# EasyEDA Pro project ProPrj_HTXStudio_OneHanded_Keyboard.epro, schematic 键盘轴_MR

## Sheets
1 keys
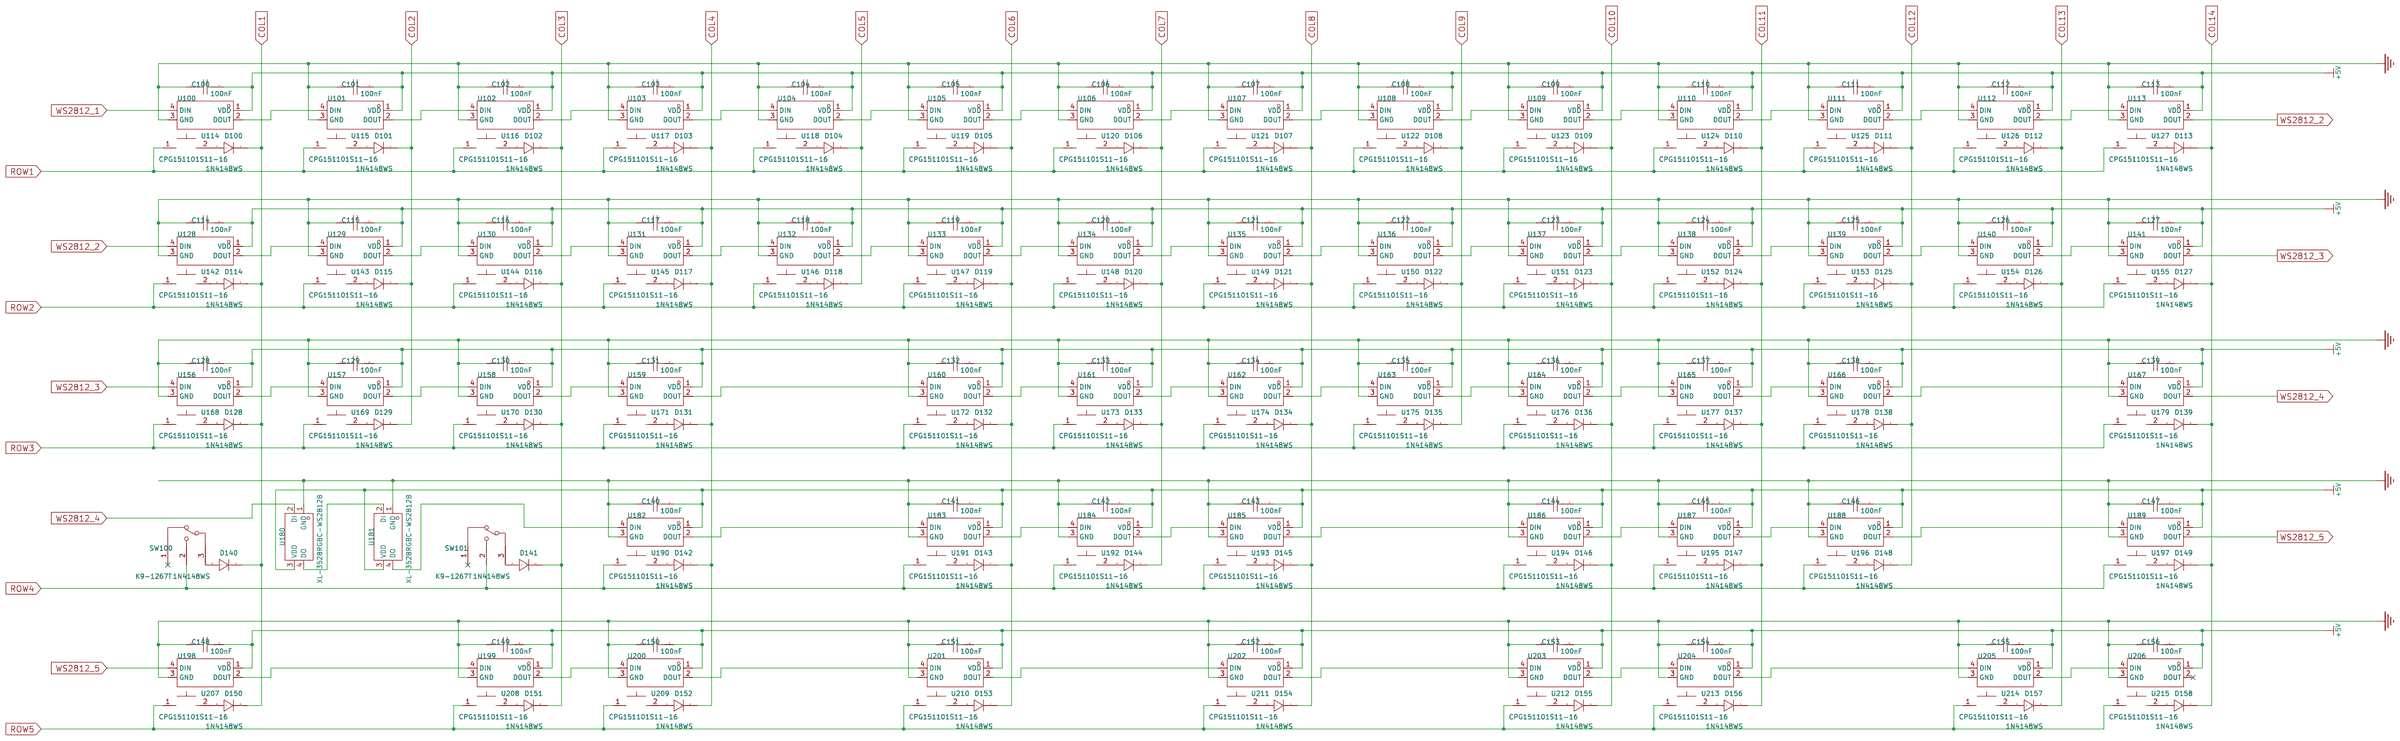
[diagram p7: keys]
2 core
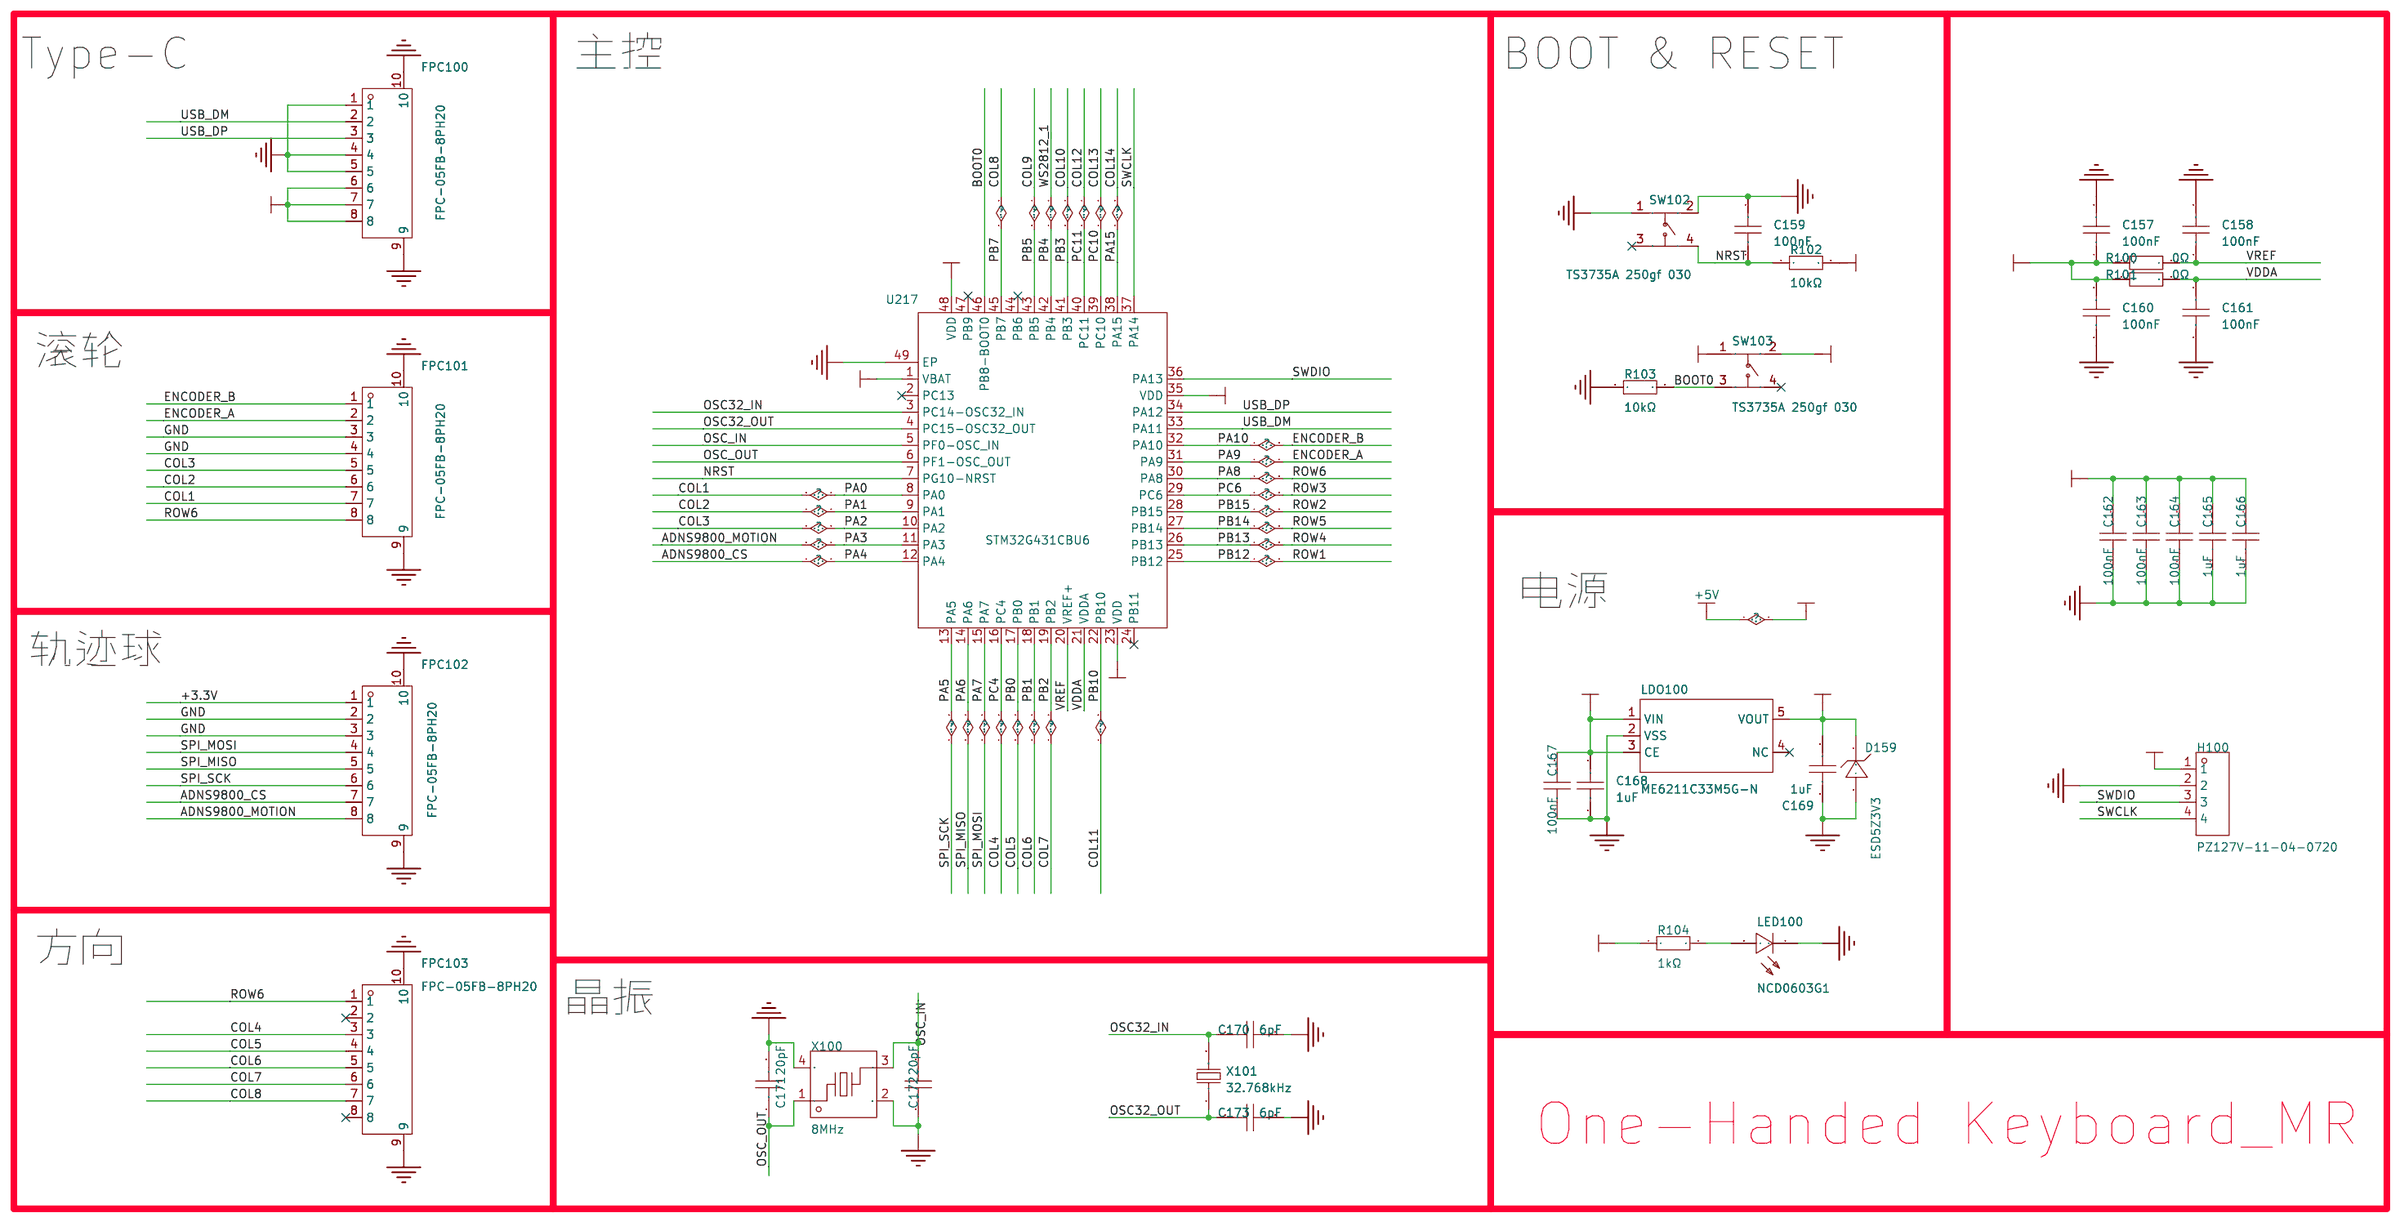
[diagram p8: core]

## Parts
sheet core
C157  100nF  [C0402]
C158  100nF  [C0402]
C159  100nF  [C0402]
C160  100nF  [C0402]
C161  100nF  [C0402]
C162  100nF  [C0402]
C163  100nF  [C0402]
C164  100nF  [C0402]
C165  1uF  [C0402]
C166  1uF  [C0402]
C167  100nF  [C0402]
C168  1uF  [C0402]
C169  1uF  [C0402]
C170  6pF  [C0402]
C171  20pF  [C0402]
C172  20pF  [C0402]
C173  6pF  [C0402]
D159  ESD5Z3V3  [SOD-523_L1.2-W0.8-LS1.6-RD]
FPC100  FPC-05FB-8PH20  [FPC-SMD_8P-P0.50_XUNPU_FPC-05FB-8PH20]
FPC101  FPC-05FB-8PH20  [FPC-SMD_8P-P0.50_XUNPU_FPC-05FB-8PH20]
FPC102  FPC-05FB-8PH20  [FPC-SMD_8P-P0.50_XUNPU_FPC-05FB-8PH20]
FPC103  FPC-05FB-8PH20  [FPC-SMD_8P-P0.50_XUNPU_FPC-05FB-8PH20]
H100  PZ127V-11-04-0720  [HDR-TH_4P-P1.27-V-M]
LDO100  ME6211C33M5G-N  [SOT-23-5_L3.0-W1.7-P0.95-LS2.8-BL]
LED100  NCD0603G1  [LED0603-RD_1]
R100  0Ω  [R0402]
R101  0Ω  [R0402]
R102  10kΩ  [R0402]
R103  10kΩ  [R0402]
R104  1kΩ  [R0402]
SW102  TS3735A 250gf 030  [SW-SMD_4P-L3.7-W3.7-P2.70-LS3.7]
SW103  TS3735A 250gf 030  [SW-SMD_4P-L3.7-W3.7-P2.70-LS3.7]
U217  STM32G431CBU6  [VQFN-48_L7.0-W7.0-P0.50-BL-EP5.5]
X100  8MHz  [CRYSTAL-SMD_4P-L3.2-W2.5-BL]
X101  32.768kHz  [FC-135R_L3.2-W1.5]
sheet keys
C100  100nF  [C0603]
C101  100nF  [C0603]
C102  100nF  [C0603]
C103  100nF  [C0603]
C104  100nF  [C0603]
C105  100nF  [C0603]
C106  100nF  [C0603]
C107  100nF  [C0603]
C108  100nF  [C0603]
C109  100nF  [C0603]
C110  100nF  [C0603]
C111  100nF  [C0603]
C112  100nF  [C0603]
C113  100nF  [C0603]
C114  100nF  [C0603]
C115  100nF  [C0603]
C116  100nF  [C0603]
C117  100nF  [C0603]
C118  100nF  [C0603]
C119  100nF  [C0603]
C120  100nF  [C0603]
C121  100nF  [C0603]
C122  100nF  [C0603]
C123  100nF  [C0603]
C124  100nF  [C0603]
C125  100nF  [C0603]
C126  100nF  [C0603]
C127  100nF  [C0603]
C128  100nF  [C0603]
C129  100nF  [C0603]
C130  100nF  [C0603]
C131  100nF  [C0603]
C132  100nF  [C0603]
C133  100nF  [C0603]
C134  100nF  [C0603]
C135  100nF  [C0603]
C136  100nF  [C0603]
C137  100nF  [C0603]
C138  100nF  [C0603]
C139  100nF  [C0603]
C140  100nF  [C0603]
C141  100nF  [C0603]
C142  100nF  [C0603]
C143  100nF  [C0603]
C144  100nF  [C0603]
C145  100nF  [C0603]
C146  100nF  [C0603]
C147  100nF  [C0603]
C148  100nF  [C0603]
C149  100nF  [C0603]
C150  100nF  [C0603]
C151  100nF  [C0603]
C152  100nF  [C0603]
C153  100nF  [C0603]
C154  100nF  [C0603]
C155  100nF  [C0603]
C156  100nF  [C0603]
D100  1N4148WS  [SOD-323_L1.8-W1.3-LS2.5-RD]
D101  1N4148WS  [SOD-323_L1.8-W1.3-LS2.5-RD]
D102  1N4148WS  [SOD-323_L1.8-W1.3-LS2.5-RD]
D103  1N4148WS  [SOD-323_L1.8-W1.3-LS2.5-RD]
D104  1N4148WS  [SOD-323_L1.8-W1.3-LS2.5-RD]
D105  1N4148WS  [SOD-323_L1.8-W1.3-LS2.5-RD]
D106  1N4148WS  [SOD-323_L1.8-W1.3-LS2.5-RD]
D107  1N4148WS  [SOD-323_L1.8-W1.3-LS2.5-RD]
D108  1N4148WS  [SOD-323_L1.8-W1.3-LS2.5-RD]
D109  1N4148WS  [SOD-323_L1.8-W1.3-LS2.5-RD]
D110  1N4148WS  [SOD-323_L1.8-W1.3-LS2.5-RD]
D111  1N4148WS  [SOD-323_L1.8-W1.3-LS2.5-RD]
D112  1N4148WS  [SOD-323_L1.8-W1.3-LS2.5-RD]
D113  1N4148WS  [SOD-323_L1.8-W1.3-LS2.5-RD]
D114  1N4148WS  [SOD-323_L1.8-W1.3-LS2.5-RD]
D115  1N4148WS  [SOD-323_L1.8-W1.3-LS2.5-RD]
D116  1N4148WS  [SOD-323_L1.8-W1.3-LS2.5-RD]
D117  1N4148WS  [SOD-323_L1.8-W1.3-LS2.5-RD]
D118  1N4148WS  [SOD-323_L1.8-W1.3-LS2.5-RD]
D119  1N4148WS  [SOD-323_L1.8-W1.3-LS2.5-RD]
D120  1N4148WS  [SOD-323_L1.8-W1.3-LS2.5-RD]
D121  1N4148WS  [SOD-323_L1.8-W1.3-LS2.5-RD]
D122  1N4148WS  [SOD-323_L1.8-W1.3-LS2.5-RD]
D123  1N4148WS  [SOD-323_L1.8-W1.3-LS2.5-RD]
D124  1N4148WS  [SOD-323_L1.8-W1.3-LS2.5-RD]
D125  1N4148WS  [SOD-323_L1.8-W1.3-LS2.5-RD]
D126  1N4148WS  [SOD-323_L1.8-W1.3-LS2.5-RD]
D127  1N4148WS  [SOD-323_L1.8-W1.3-LS2.5-RD]
D128  1N4148WS  [SOD-323_L1.8-W1.3-LS2.5-RD]
D129  1N4148WS  [SOD-323_L1.8-W1.3-LS2.5-RD]
D130  1N4148WS  [SOD-323_L1.8-W1.3-LS2.5-RD]
D131  1N4148WS  [SOD-323_L1.8-W1.3-LS2.5-RD]
D132  1N4148WS  [SOD-323_L1.8-W1.3-LS2.5-RD]
D133  1N4148WS  [SOD-323_L1.8-W1.3-LS2.5-RD]
D134  1N4148WS  [SOD-323_L1.8-W1.3-LS2.5-RD]
D135  1N4148WS  [SOD-323_L1.8-W1.3-LS2.5-RD]
D136  1N4148WS  [SOD-323_L1.8-W1.3-LS2.5-RD]
D137  1N4148WS  [SOD-323_L1.8-W1.3-LS2.5-RD]
D138  1N4148WS  [SOD-323_L1.8-W1.3-LS2.5-RD]
D139  1N4148WS  [SOD-323_L1.8-W1.3-LS2.5-RD]
D140  1N4148WS  [SOD-323_L1.8-W1.3-LS2.5-RD]
D141  1N4148WS  [SOD-323_L1.8-W1.3-LS2.5-RD]
D142  1N4148WS  [SOD-323_L1.8-W1.3-LS2.5-RD]
D143  1N4148WS  [SOD-323_L1.8-W1.3-LS2.5-RD]
D144  1N4148WS  [SOD-323_L1.8-W1.3-LS2.5-RD]
D145  1N4148WS  [SOD-323_L1.8-W1.3-LS2.5-RD]
D146  1N4148WS  [SOD-323_L1.8-W1.3-LS2.5-RD]
D147  1N4148WS  [SOD-323_L1.8-W1.3-LS2.5-RD]
D148  1N4148WS  [SOD-323_L1.8-W1.3-LS2.5-RD]
D149  1N4148WS  [SOD-323_L1.8-W1.3-LS2.5-RD]
D150  1N4148WS  [SOD-323_L1.8-W1.3-LS2.5-RD]
D151  1N4148WS  [SOD-323_L1.8-W1.3-LS2.5-RD]
D152  1N4148WS  [SOD-323_L1.8-W1.3-LS2.5-RD]
D153  1N4148WS  [SOD-323_L1.8-W1.3-LS2.5-RD]
D154  1N4148WS  [SOD-323_L1.8-W1.3-LS2.5-RD]
D155  1N4148WS  [SOD-323_L1.8-W1.3-LS2.5-RD]
D156  1N4148WS  [SOD-323_L1.8-W1.3-LS2.5-RD]
D157  1N4148WS  [SOD-323_L1.8-W1.3-LS2.5-RD]
D158  1N4148WS  [SOD-323_L1.8-W1.3-LS2.5-RD]
SW100  K9-1267T  [SW-TH_K9-1267T]
SW101  K9-1267T  [SW-TH_K9-1267T]
U100  Yo-WS2812B-3528反贴雾状  [LED-SMD_L3.2-W2.8_YO-WS2812B-3528]
U101  Yo-WS2812B-3528反贴雾状  [LED-SMD_L3.2-W2.8_YO-WS2812B-3528]
U102  Yo-WS2812B-3528反贴雾状  [LED-SMD_L3.2-W2.8_YO-WS2812B-3528]
U103  Yo-WS2812B-3528反贴雾状  [LED-SMD_L3.2-W2.8_YO-WS2812B-3528]
U104  Yo-WS2812B-3528反贴雾状  [LED-SMD_L3.2-W2.8_YO-WS2812B-3528]
U105  Yo-WS2812B-3528反贴雾状  [LED-SMD_L3.2-W2.8_YO-WS2812B-3528]
U106  Yo-WS2812B-3528反贴雾状  [LED-SMD_L3.2-W2.8_YO-WS2812B-3528]
U107  Yo-WS2812B-3528反贴雾状  [LED-SMD_L3.2-W2.8_YO-WS2812B-3528]
U108  Yo-WS2812B-3528反贴雾状  [LED-SMD_L3.2-W2.8_YO-WS2812B-3528]
U109  Yo-WS2812B-3528反贴雾状  [LED-SMD_L3.2-W2.8_YO-WS2812B-3528]
U110  Yo-WS2812B-3528反贴雾状  [LED-SMD_L3.2-W2.8_YO-WS2812B-3528]
U111  Yo-WS2812B-3528反贴雾状  [LED-SMD_L3.2-W2.8_YO-WS2812B-3528]
U112  Yo-WS2812B-3528反贴雾状  [LED-SMD_L3.2-W2.8_YO-WS2812B-3528]
U113  Yo-WS2812B-3528反贴雾状  [LED-SMD_L3.2-W2.8_YO-WS2812B-3528]
U114  CPG151101S11-16  [SMD_KEYBOARD-SW]
U115  CPG151101S11-16  [SMD_KEYBOARD-SW]
U116  CPG151101S11-16  [SMD_KEYBOARD-SW]
U117  CPG151101S11-16  [SMD_KEYBOARD-SW]
U118  CPG151101S11-16  [SMD_KEYBOARD-SW]
U119  CPG151101S11-16  [SMD_KEYBOARD-SW]
U120  CPG151101S11-16  [SMD_KEYBOARD-SW]
U121  CPG151101S11-16  [SMD_KEYBOARD-SW]
U122  CPG151101S11-16  [SMD_KEYBOARD-SW]
U123  CPG151101S11-16  [SMD_KEYBOARD-SW]
U124  CPG151101S11-16  [SMD_KEYBOARD-SW]
U125  CPG151101S11-16  [SMD_KEYBOARD-SW]
U126  CPG151101S11-16  [SMD_KEYBOARD-SW]
U127  CPG151101S11-16  [SMD_KEYBOARD-SW]
U128  Yo-WS2812B-3528反贴雾状  [LED-SMD_L3.2-W2.8_YO-WS2812B-3528]
U129  Yo-WS2812B-3528反贴雾状  [LED-SMD_L3.2-W2.8_YO-WS2812B-3528]
U130  Yo-WS2812B-3528反贴雾状  [LED-SMD_L3.2-W2.8_YO-WS2812B-3528]
U131  Yo-WS2812B-3528反贴雾状  [LED-SMD_L3.2-W2.8_YO-WS2812B-3528]
U132  Yo-WS2812B-3528反贴雾状  [LED-SMD_L3.2-W2.8_YO-WS2812B-3528]
U133  Yo-WS2812B-3528反贴雾状  [LED-SMD_L3.2-W2.8_YO-WS2812B-3528]
U134  Yo-WS2812B-3528反贴雾状  [LED-SMD_L3.2-W2.8_YO-WS2812B-3528]
U135  Yo-WS2812B-3528反贴雾状  [LED-SMD_L3.2-W2.8_YO-WS2812B-3528]
U136  Yo-WS2812B-3528反贴雾状  [LED-SMD_L3.2-W2.8_YO-WS2812B-3528]
U137  Yo-WS2812B-3528反贴雾状  [LED-SMD_L3.2-W2.8_YO-WS2812B-3528]
U138  Yo-WS2812B-3528反贴雾状  [LED-SMD_L3.2-W2.8_YO-WS2812B-3528]
U139  Yo-WS2812B-3528反贴雾状  [LED-SMD_L3.2-W2.8_YO-WS2812B-3528]
U140  Yo-WS2812B-3528反贴雾状  [LED-SMD_L3.2-W2.8_YO-WS2812B-3528]
U141  Yo-WS2812B-3528反贴雾状  [LED-SMD_L3.2-W2.8_YO-WS2812B-3528]
U142  CPG151101S11-16  [SMD_KEYBOARD-SW]
U143  CPG151101S11-16  [SMD_KEYBOARD-SW]
U144  CPG151101S11-16  [SMD_KEYBOARD-SW]
U145  CPG151101S11-16  [SMD_KEYBOARD-SW]
U146  CPG151101S11-16  [SMD_KEYBOARD-SW]
U147  CPG151101S11-16  [SMD_KEYBOARD-SW]
U148  CPG151101S11-16  [SMD_KEYBOARD-SW]
U149  CPG151101S11-16  [SMD_KEYBOARD-SW]
U150  CPG151101S11-16  [SMD_KEYBOARD-SW]
U151  CPG151101S11-16  [SMD_KEYBOARD-SW]
U152  CPG151101S11-16  [SMD_KEYBOARD-SW]
U153  CPG151101S11-16  [SMD_KEYBOARD-SW]
U154  CPG151101S11-16  [SMD_KEYBOARD-SW]
U155  CPG151101S11-16  [SMD_KEYBOARD-SW]
U156  Yo-WS2812B-3528反贴雾状  [LED-SMD_L3.2-W2.8_YO-WS2812B-3528]
U157  Yo-WS2812B-3528反贴雾状  [LED-SMD_L3.2-W2.8_YO-WS2812B-3528]
U158  Yo-WS2812B-3528反贴雾状  [LED-SMD_L3.2-W2.8_YO-WS2812B-3528]
U159  Yo-WS2812B-3528反贴雾状  [LED-SMD_L3.2-W2.8_YO-WS2812B-3528]
U160  Yo-WS2812B-3528反贴雾状  [LED-SMD_L3.2-W2.8_YO-WS2812B-3528]
U161  Yo-WS2812B-3528反贴雾状  [LED-SMD_L3.2-W2.8_YO-WS2812B-3528]
U162  Yo-WS2812B-3528反贴雾状  [LED-SMD_L3.2-W2.8_YO-WS2812B-3528]
U163  Yo-WS2812B-3528反贴雾状  [LED-SMD_L3.2-W2.8_YO-WS2812B-3528]
U164  Yo-WS2812B-3528反贴雾状  [LED-SMD_L3.2-W2.8_YO-WS2812B-3528]
U165  Yo-WS2812B-3528反贴雾状  [LED-SMD_L3.2-W2.8_YO-WS2812B-3528]
U166  Yo-WS2812B-3528反贴雾状  [LED-SMD_L3.2-W2.8_YO-WS2812B-3528]
U167  Yo-WS2812B-3528反贴雾状  [LED-SMD_L3.2-W2.8_YO-WS2812B-3528]
U168  CPG151101S11-16  [SMD_KEYBOARD-SW]
U169  CPG151101S11-16  [SMD_KEYBOARD-SW]
U170  CPG151101S11-16  [SMD_KEYBOARD-SW]
U171  CPG151101S11-16  [SMD_KEYBOARD-SW]
U172  CPG151101S11-16  [SMD_KEYBOARD-SW]
U173  CPG151101S11-16  [SMD_KEYBOARD-SW]
U174  CPG151101S11-16  [SMD_KEYBOARD-SW]
U175  CPG151101S11-16  [SMD_KEYBOARD-SW]
U176  CPG151101S11-16  [SMD_KEYBOARD-SW]
U177  CPG151101S11-16  [SMD_KEYBOARD-SW]
U178  CPG151101S11-16  [SMD_KEYBOARD-SW]
U179  CPG151101S11-16  [SMD_KEYBOARD-SW]
U180  XL-3528RGBC-WS2812B  [LED-SMD_4P-L3.5-W2.8-BR-1]
U181  XL-3528RGBC-WS2812B  [LED-SMD_4P-L3.5-W2.8-BR-1]
U182  Yo-WS2812B-3528反贴雾状  [LED-SMD_L3.2-W2.8_YO-WS2812B-3528]
U183  Yo-WS2812B-3528反贴雾状  [LED-SMD_L3.2-W2.8_YO-WS2812B-3528]
U184  Yo-WS2812B-3528反贴雾状  [LED-SMD_L3.2-W2.8_YO-WS2812B-3528]
U185  Yo-WS2812B-3528反贴雾状  [LED-SMD_L3.2-W2.8_YO-WS2812B-3528]
U186  Yo-WS2812B-3528反贴雾状  [LED-SMD_L3.2-W2.8_YO-WS2812B-3528]
U187  Yo-WS2812B-3528反贴雾状  [LED-SMD_L3.2-W2.8_YO-WS2812B-3528]
U188  Yo-WS2812B-3528反贴雾状  [LED-SMD_L3.2-W2.8_YO-WS2812B-3528]
U189  Yo-WS2812B-3528反贴雾状  [LED-SMD_L3.2-W2.8_YO-WS2812B-3528]
U190  CPG151101S11-16  [SMD_KEYBOARD-SW]
U191  CPG151101S11-16  [SMD_KEYBOARD-SW]
U192  CPG151101S11-16  [SMD_KEYBOARD-SW]
U193  CPG151101S11-16  [SMD_KEYBOARD-SW]
U194  CPG151101S11-16  [SMD_KEYBOARD-SW]
U195  CPG151101S11-16  [SMD_KEYBOARD-SW]
U196  CPG151101S11-16  [SMD_KEYBOARD-SW]
U197  CPG151101S11-16  [SMD_KEYBOARD-SW]
U198  Yo-WS2812B-3528反贴雾状  [LED-SMD_L3.2-W2.8_YO-WS2812B-3528]
U199  Yo-WS2812B-3528反贴雾状  [LED-SMD_L3.2-W2.8_YO-WS2812B-3528]
U200  Yo-WS2812B-3528反贴雾状  [LED-SMD_L3.2-W2.8_YO-WS2812B-3528]
U201  Yo-WS2812B-3528反贴雾状  [LED-SMD_L3.2-W2.8_YO-WS2812B-3528]
U202  Yo-WS2812B-3528反贴雾状  [LED-SMD_L3.2-W2.8_YO-WS2812B-3528]
U203  Yo-WS2812B-3528反贴雾状  [LED-SMD_L3.2-W2.8_YO-WS2812B-3528]
U204  Yo-WS2812B-3528反贴雾状  [LED-SMD_L3.2-W2.8_YO-WS2812B-3528]
U205  Yo-WS2812B-3528反贴雾状  [LED-SMD_L3.2-W2.8_YO-WS2812B-3528]
U206  Yo-WS2812B-3528反贴雾状  [LED-SMD_L3.2-W2.8_YO-WS2812B-3528]
U207  CPG151101S11-16  [SMD_KEYBOARD-SW]
U208  CPG151101S11-16  [SMD_KEYBOARD-SW]
U209  CPG151101S11-16  [SMD_KEYBOARD-SW]
U210  CPG151101S11-16  [SMD_KEYBOARD-SW]
U211  CPG151101S11-16  [SMD_KEYBOARD-SW]
U212  CPG151101S11-16  [SMD_KEYBOARD-SW]
U213  CPG151101S11-16  [SMD_KEYBOARD-SW]
U214  CPG151101S11-16  [SMD_KEYBOARD-SW]
U215  CPG151101S11-16  [SMD_KEYBOARD-SW]

## Library data of the parts
C157-C164 C167 = CL05B104KB54PNC: 容值:100nF;精度:±10%;额定电压:50V;材质(温度系数):X7R;; LCSC Part Name: 100nF ±10% 50V; Supplier Part: C307331; Manufacturer: SAMSUNG(三星); Supplier Footprint: 0402; JLCPCB Part Class: 基础库; Datasheet: https://atta.szlcsc.com/upload/public/pdf/source/20160218/1457707763339.pdf; Supplier: LCSC; Tolerance: ±10%; Voltage Rated: 50V; Temperature Coefficient: X7R
C165 C166 C168 C169 = CL05A105KA5NQNC: 容值:1uF;精度:±10%;额定电压:25V;材质(温度系数):X5R;; LCSC Part Name: 1uF ±10% 25V; Supplier Part: C52923; Manufacturer: SAMSUNG(三星); Supplier Footprint: 0402; JLCPCB Part Class: Basic Part; Datasheet: https://atta.szlcsc.com/upload/public/pdf/source/20160218/1457707763339.pdf; Supplier: LCSC; Tolerance: ±10%; Voltage Rated: 25V; Temperature Coefficient: X5R
C170 C173 = GJM1555C1H6R0WB01D: 容值:6pF;额定电压:50V;材质(温度系数):C0G;; LCSC Part Name: 6pF 50V; Supplier Part: C882557; Manufacturer: muRata(村田); Supplier Footprint: 0402; JLCPCB Part Class: 扩展库; Datasheet: https://atta.szlcsc.com/upload/public/pdf/source/20201228/C882557_CC42579B2F91491CB41A68597C1310CF.pdf; Supplier: LCSC; Voltage Rated: 50V; Temperature Coefficient: C0G
C171 C172 = GRM1555C1H200JA01D: 容值:20pF;精度:±5%;额定电压:50V;材质(温度系数):C0G;; LCSC Part Name: 20pF ±5% 50V; Supplier Part: C76959; Manufacturer: muRata(村田); Supplier Footprint: 0402; JLCPCB Part Class: 扩展库; Datasheet: https://atta.szlcsc.com/upload/public/pdf/source/20180307/C76959_15204091273971407747.pdf; Supplier: LCSC; Tolerance: ±5%; Voltage Rated: 50V; Temperature Coefficient: C0G
D159 = ESD5Z3V3_C2841409: +3.3V; Supplier Part: C2841409; Manufacturer: TECH PUBLIC(台舟); Supplier Footprint: SOD-523; JLCPCB Part Class: 扩展库; Datasheet: https://atta.szlcsc.com/upload/public/pdf/source/20211010/C2841409_E778AEF8B577E7561120661F012F3EB1.pdf; Supplier: LCSC; polarity: 单向; Reverse Stand-Off Voltage (Vrwm): +3.3V; Maximum Clamping Voltage: 14V; Breakdown Voltage: 5V; Reverse Leakage Current (Ir): 200nA; Number of Lines: 单路
FPC100-FPC103 = FPC-05FB-8PH20: 锁定特性:翻盖式;触点类型:双侧触点/上下接;触点数量:8P;间距:0.5mm;安装类型:卧贴;工作温度范围:-25℃~+85℃;; LCSC Part Name: 间距:0.5mm P数:8P 翻盖式 双侧触点/上下接; Supplier Part: C2856828; Manufacturer: XUNPU(讯普); Supplier Footprint: SMD,P=0.5mm,卧贴; JLCPCB Part Class: 扩展库; Datasheet: https://atta.szlcsc.com/upload/public/pdf/source/20210922/C2856828_96968FB666CC1781EEE4F204CBA73B0B.pdf; Supplier: LCSC; Locking Feature: 翻盖式; Contact Type: 双侧触点/上下接; Number of Contacts: 8P; Pitch: 0.5mm; Mounting Type: 卧贴; FFC, FCB Thickness: 0.3mm; Height Above Board: 2mm; Operating Temperature Range: -25℃~+85℃
H100 = PZ127V-11-04-0720: 插针结构:1x4P;间距:1.27mm;行距:-;圆针/方针:-;安装类型:直插;排数:单排;总PIN位数:4P;额定电流:-;额定电压:-;配合针长度:3.9mm;塑高:1mm;端接针长度:2.3mm;触头材质:黄铜;触头镀层:-;工作温度范围:-40℃~+105℃;焊接温度(最大值):-;颜色:黑色;; LCSC Part Name: 间距:1.27mm 1x4P 直插; Supplier Part: C541879; Manufacturer: XFCN(兴飞); Supplier Footprint: 插件,P=1.27mm; JLCPCB Part Class: 扩展库; Datasheet: https://atta.szlcsc.com/upload/public/pdf/source/20200519/C541879_5CD99C402ABEE613587AE88FBA356357.pdf; Supplier: LCSC; Pin Structure: 1x4P; Pitch: 1.27mm; Mounting Type: 直插; Number of Rows: 单排; Number of Pins: 4P; Length of Mating Pin: 3.9mm; Insulation Height: 1mm; Length of End Connection Pin: 2.3mm; Contact Material: 黄铜; Operating Temperature Range: -40℃~+105℃; Color: 黑色
LDO100 = ME6211C33M5G-N: 输出类型:固定;工作电压:6V;输出电压:3.3V;输出电流:500mA;电源纹波抑制比(PSRR):70dB@(1kHz)；62dB@(10kHz);输出极性:正极;; LCSC Part Name: 输入6V 输出3.3V 500mA; Supplier Part: C82942; Manufacturer: MICRONE(南京微盟); Supplier Footprint: SOT-23-5; JLCPCB Part Class: 扩展库; Datasheet: https://atta.szlcsc.com/upload/public/pdf/source/20170918/C82942_1505727073070976520.pdf; Supplier: LCSC; Output Type: 固定; Voltage - Supply: 6V; Output Voltage: 3.3V; Output Current: 500mA; Power Supply Rejection Ratio (PSRR): 70dB@(1kHz)；62dB@(10kHz); Voltage Dropout: 260mV@(200mA); Features: 短路保护(SCP)；低ESR；过流保护(OCP)；带使能; Output Configuration: 正极; Number of Outputs: 1
LED100 = NCD0603G1: 发光颜色:翠绿色;正向电压(VF):2.6V~3.6V;功率:72mW;正向电流:10mA;主波长:515nm~530nm;透镜颜色:无色透明透镜;发光强度:330mcd~900mcd;发光角度:130°;工作温度:-30℃~+85℃;; Supplier Part: C84267; Manufacturer: 国星光电; Supplier Footprint: 0603; JLCPCB Part Class: 扩展库; Datasheet: https://atta.szlcsc.com/upload/public/pdf/source/20200820/C84267_04BA7703640BAC111D09F5EFB971FBF3.pdf; Supplier: LCSC; Emitted Color: 翠绿色; Forward Voltage (VF): 2.6V~3.6V; Power Dissipation: 72mW; Forward Current: 10mA; Dominant Wavelength: 515nm~530nm; Lens Color: 无色透明透镜; Luminous Intensity: 330mcd~900mcd; Viewing Angle: 130°; Operating Temperature: -30℃~+85℃
R100 R101 = 0402WGF0000TCE: 电阻类型:厚膜电阻;阻值:0Ω;精度:±1%;功率:62.5mW;最大工作电压:50V;温度系数:±800ppm/℃;; LCSC Part Name: 0Ω ±1% 62.5mW 厚膜电阻; Supplier Part: C17168; Manufacturer: UNI-ROYAL(厚声); Supplier Footprint: 0402; JLCPCB Part Class: Basic Part; Datasheet: https://atta.szlcsc.com/upload/public/pdf/source/20200306/C422600_1E6D84923E4A46A82E41ADD87F860B5C.pdf; Supplier: LCSC; Type: 厚膜电阻; Tolerance: ±1%; Power(Watts): 62.5mW; Overload Voltage (Max): 50V; Temperature Coefficient: ±800ppm/℃; Operating Temperature Range: -55℃~+155℃
R102 R103 = 0402WGF1002TCE: 电阻类型:厚膜电阻;阻值:10kΩ;精度:±1%;功率:62.5mW;最大工作电压:50V;温度系数:±100ppm/℃;; LCSC Part Name: 10kΩ ±1% 62.5mW 厚膜电阻; Supplier Part: C25744; Manufacturer: UNI-ROYAL(厚声); Supplier Footprint: 0402; JLCPCB Part Class: 基础库; Datasheet: https://atta.szlcsc.com/upload/public/pdf/source/20200306/C422600_1E6D84923E4A46A82E41ADD87F860B5C.pdf; Supplier: LCSC; Type: 厚膜电阻; Tolerance: ±1%; Power(Watts): 62.5mW; Overload Voltage (Max): 50V; Temperature Coefficient: ±100ppm/℃; Operating Temperature Range: -55℃~+155℃
R104 = 0402WGF1001TCE: 电阻类型:厚膜电阻;阻值:1kΩ;精度:±1%;功率:62.5mW;最大工作电压:50V;温度系数:±100ppm/℃;; LCSC Part Name: 1kΩ ±1% 62.5mW 厚膜电阻; Supplier Part: C11702; Manufacturer: UNI-ROYAL(厚声); Supplier Footprint: 0402; JLCPCB Part Class: Basic Part; Datasheet: https://atta.szlcsc.com/upload/public/pdf/source/20200306/C422600_1E6D84923E4A46A82E41ADD87F860B5C.pdf; Supplier: LCSC; Type: 厚膜电阻; Tolerance: ±1%; Power(Watts): 62.5mW; Overload Voltage (Max): 50V; Temperature Coefficient: ±100ppm/℃; Operating Temperature Range: -55℃~+155℃
SW102 SW103 = TS3735A 250gf 030: 电路结构:单刀单掷;按钮形状:圆形按钮;作用力:2.5N;安装方式:立贴;开关长度:3.7mm;开关宽度:3.7mm;开关高度:0.35mm;带支架:不带;触点电流:50mA;额定电压(DC):12V;绝缘电阻:100MΩ;机械寿命:3万次;; LCSC Part Name: 3.7*3.7*0.35mm 立贴 轻触开关; Supplier Part: C2906282; Manufacturer: SHOU HAN(首韩); Supplier Footprint: SMD; JLCPCB Part Class: 扩展库; Datasheet: https://atta.szlcsc.com/upload/public/pdf/source/20211019/126A9D1EE678E2ED4D7ADF984A8B9751.pdf; Supplier: LCSC; Circuit: 单刀单掷; Actuator Style: 圆形按钮; Operating Force: 2.5N; Mounting Style: 立贴; Switch Length: 3.7mm; Switch Width: 3.7mm; Switch Height: 0.35mm; Strike Gundam: 不带; Contact Current: 50mA; Voltage Rating (DC): 12V; Insulation Resistance: 100MΩ; Actuator/Cap Color: 黄色; Pin Style: SMD接片; Mechanical Life: 3万次; Operating Temperature: -20℃~+70℃
U217 = STM32G431CBU6: CPU内核:ARM-M系列;CPU最大主频:170MHz;应用领域:-;; LCSC Part Name: 带DSP和FPU的170MHz主流ARM Cortex-M4 MCU，具有128 KB Flash存储器、数学加速器和中等模拟电平集成; Supplier Part: C529356; Manufacturer: ST(意法半导体); Supplier Footprint: UFQFPN-48(7x7); JLCPCB Part Class: Extended Part; Datasheet: https://atta.szlcsc.com/upload/public/pdf/source/20200511/C529354_7C66CF00837B904D0C15DCE45B69418C.pdf; Supplier: LCSC; CPU Core: ARM-M系列; CPU Maximum Speed: 170MHz; Program Storage Size: 128KB; Program Memory Type: FLASH; Number of I/O: 42; ADC (Bit): 12bit; DAC (Bit): 12bit; Low Voltage Detection Threshold: 1.71V~3.6V
X100 = X32258MSB4SI: 晶振类型:贴片晶振;频率:8MHz;常温频差:±10ppm;负载电容:20pF;频率稳定度:±20ppm;; LCSC Part Name: 8MHz ±10ppm 20pF; Supplier Part: C2682774; Manufacturer: YXC(扬兴晶振); Supplier Footprint: SMD3225-4P; JLCPCB Part Class: Extended Part; Datasheet: https://atta.szlcsc.com/upload/public/pdf/source/20240329/19D5F850207469550BEB00D7DFEDBC7A.pdf; Supplier: LCSC; Type: 贴片晶振; Normal temperature Frequency Tolerance: ±10ppm; Load Capacitance: 20pF; Frequency Stability: ±20ppm; Operating Temperature: -40℃~+85℃
X101 = Q13FC13500004_C32346: 晶振类型:贴片晶振;频率:32.768kHz;常温频差:±20ppm;负载电容:12.5pF;; LCSC Part Name: 32.768kHz ±20ppm 12.5pF; Supplier Part: C32346; Manufacturer: EPSON(爱普生); Manufacturer Part: Q13FC13500004; Supplier Footprint: SMD3215-2P; JLCPCB Part Class: 基础库; Datasheet: https://atta.szlcsc.com/upload/public/pdf/source/20240418/0E0FF5F0356BA3753F616001439D1416.pdf; Supplier: LCSC; Crystal Type: 贴片晶振; Normal temperature Frequency Tolerance: ±20ppm; Load Capacitor: 12.5pF; Equivalent Series Resistance (ESR): 70kΩ; Operating Temperature: -40℃~+85℃
C100-C156 = CC0603KRX7R9BB104: 容值:100nF;精度:±10%;额定电压:50V;材质(温度系数):X7R;; LCSC Part Name: 100nF ±10% 50V; Supplier Part: C14663; Manufacturer: YAGEO(国巨); Supplier Footprint: 0603; JLCPCB Part Class: 基础库; Datasheet: https://atta.szlcsc.com/upload/public/pdf/source/20180910/C282072_33301C7F631E79921B82A8DAC6BCC5B3.pdf; Supplier: LCSC; Tolerance: ±10%; Voltage Rated: 50V; Temperature Coefficient: X7R
D100-D139 D142-D158 = 1N4148WS_C2128: 二极管配置:独立式;正向压降(Vf):1.25V@150mA;直流反向耐压(Vr):100V;整流电流:150mA;反向恢复时间(trr):4ns;; LCSC Part Name: 丝印T4; Supplier Part: C2128; Manufacturer: CJ(江苏长电/长晶); Supplier Footprint: SOD-323; JLCPCB Part Class: 基础库; Datasheet: https://atta.szlcsc.com/upload/public/pdf/source/20140809/1457707208178.pdf; Supplier: LCSC; Diode Configuration: 独立式; Forward Voltage (Vf@If): 1.25V@150mA; Reverse Voltage (Vr): 100V; Rectified Current: 150mA; Reverse Leakage Current (Ir): 1uA@75V; Reverse Recovery Time (trr): 4ns
D140 D141 = 1N4148WS_C437156: 二极管配置:独立式;正向压降(Vf):1.25V@150mA;直流反向耐压(Vr):100V;整流电流:150mA;反向恢复时间(trr):4ns;; LCSC Part Name: 电压:100V 电流:150mA; Supplier Part: C437156; Manufacturer: MDD(辰达半导体); Supplier Footprint: SOD-323; JLCPCB Part Class: 扩展库; Datasheet: https://atta.szlcsc.com/upload/public/pdf/source/20230823/12C4B88004F768DBC940AB716F9D26AA.pdf; Supplier: LCSC; Diode Configuration: 独立式; Forward Voltage (Vf@If): 1.25V@150mA; Reverse Voltage (Vr): 100V; Rectified Current: 150mA; Reverse Leakage Current: 25nA@20V; Reverse Recovery Time (trr): 4ns; Operating Temperature: -55℃~+150℃@(Tj)
SW100 SW101 = K9-1267T: 类型:微动开关;电路结构:单刀双掷;额定电流(DC):100mA;额定电压(DC):30V;额定电流(AC):-;额定电压(AC):-;机械寿命:300万次;; LCSC Part Name: 12.7*5.7*7.5mm 插件微动开关; Supplier Part: C107266; Manufacturer: 韩国韩荣; Supplier Footprint: 插件; JLCPCB Part Class: 扩展库; Datasheet: https://atta.szlcsc.com/upload/public/pdf/source/20170413/1492062748888.pdf; Supplier: LCSC; Type: 微动开关; Circuit: 单刀双掷; Switch Length: 12.7mm; Switch Width: 5.7mm; Switch Height: 7.5mm; Contact Current (DC): 100mA; Voltage Rating (DC): 30V; Mechanical Life: 300万次; Operating Temperature: -25℃~+85℃
U100-U113 U128-U141 U156-U167 U182-U189 U198-U206 = Yo-WS2812B-3528反贴雾状: Supplier Part: C9900003682; Supplier Footprint: LED-SMD_L3.2-W2.8-BR_DY-S35281; JLCPCB Part Class: 扩展库; Supplier: LCSC
U114-U127 U142-U155 U168-U179 U190-U197 U207-U215 = CPG151101S11-16_C41430893: 热插拔底座连接器 键盘配件; LCSC Part Name: 热插拔底座连接器 键盘配件; Supplier Part: C41430893; Manufacturer: HanElectricity(瀚源); Supplier Footprint: SMD,14.5x5.9mm; JLCPCB Part Class: 扩展库; Datasheet: https://atta.szlcsc.com/upload/public/pdf/source/20241016/CAB9C3DABBAD4306660C041376EEF732.pdf; Supplier: LCSC
U180 U181 = XL-3528RGBC-WS2812B: Supplier Part: C5440693; Manufacturer: XINGLIGHT(成兴光); Supplier Footprint: SMD-4P,3.5x2.8mm; JLCPCB Part Class: 扩展库; Datasheet: https://atta.szlcsc.com/upload/public/pdf/source/20240613/4CD4F2CA4289EE385C338CCDDE94EC30.pdf; Supplier: LCSC

## Nets
+3.3V: C157.1 C160.2 C162.2 C163.2 C164.2 C165.2 C166.2 C169.2 D159.1(C) FPC102.1 H100.1 LDO100.5(VOUT) R100.1 R101.1 R102.2 R104.1 SW103.1 SW103.2 U217.1(VBAT) U217.23(VDD) U217.35(VDD) U217.48(VDD)
+5V: C100.2 C101.2 C102.2 C103.2 C104.2 C105.2 C106.2 C107.2 C108.2 C109.2 C110.2 C111.2 C112.2 C113.2 C114.2 C115.2 C116.2 C117.2 C118.2 C119.2 C120.2 C121.2 C122.2 C123.2 C124.2 C125.2 C126.2 C127.2 C128.2 C129.2 C130.2 C131.2 C132.2 C133.2 C134.2 C135.2 C136.2 C137.2 C138.2 C139.2 C140.2 C141.2 C142.2 C143.2 C144.2 C145.2 C146.2 C147.2 C148.2 C149.2 C150.2 C151.2 C152.2 C153.2 C154.2 C155.2 C156.2 C167.2 C168.2 FPC100.6 FPC100.7 FPC100.8 LDO100.1(VIN) LDO100.3(CE) U100.1(VDD) U101.1(VDD) U102.1(VDD) U103.1(VDD) U104.1(VDD) U105.1(VDD) U106.1(VDD) U107.1(VDD) U108.1(VDD) U109.1(VDD) U110.1(VDD) U111.1(VDD) U112.1(VDD) U113.1(VDD) U128.1(VDD) U129.1(VDD) U130.1(VDD) U131.1(VDD) U132.1(VDD) U133.1(VDD) U134.1(VDD) U135.1(VDD) U136.1(VDD) U137.1(VDD) U138.1(VDD) U139.1(VDD) U140.1(VDD) U141.1(VDD) U156.1(VDD) U157.1(VDD) U158.1(VDD) U159.1(VDD) U160.1(VDD) U161.1(VDD) U162.1(VDD) U163.1(VDD) U164.1(VDD) U165.1(VDD) U166.1(VDD) U167.1(VDD) U180.3(VDD) U181.3(VDD) U182.1(VDD) U183.1(VDD) U184.1(VDD) U185.1(VDD) U186.1(VDD) U187.1(VDD) U188.1(VDD) U189.1(VDD) U198.1(VDD) U199.1(VDD) U200.1(VDD) U201.1(VDD) U202.1(VDD) U203.1(VDD) U204.1(VDD) U205.1(VDD) U206.1(VDD)
GND: C100.1 C101.1 C102.1 C103.1 C104.1 C105.1 C106.1 C107.1 C108.1 C109.1 C110.1 C111.1 C112.1 C113.1 C114.1 C115.1 C116.1 C117.1 C118.1 C119.1 C120.1 C121.1 C122.1 C123.1 C124.1 C125.1 C126.1 C127.1 C128.1 C129.1 C130.1 C131.1 C132.1 C133.1 C134.1 C135.1 C136.1 C137.1 C138.1 C139.1 C140.1 C141.1 C142.1 C143.1 C144.1 C145.1 C146.1 C147.1 C148.1 C149.1 C150.1 C151.1 C152.1 C153.1 C154.1 C155.1 C156.1 C157.2 C158.2 C159.2 C160.1 C161.1 C162.1 C163.1 C164.1 C165.1 C166.1 C167.1 C168.1 C169.1 C170.2 C171.2 C172.1 C173.2 D159.2(A) FPC100.1 FPC100.4 FPC100.5 FPC100.9 FPC100.10 FPC101.3 FPC101.4 FPC101.9 FPC101.10 FPC102.2 FPC102.3 FPC102.9 FPC102.10 FPC103.9 FPC103.10 H100.2 LDO100.2(VSS) LED100.1(K) R103.1 SW102.1 SW102.2 U100.3(GND) U101.3(GND) U102.3(GND) U103.3(GND) U104.3(GND) U105.3(GND) U106.3(GND) U107.3(GND) U108.3(GND) U109.3(GND) U110.3(GND) U111.3(GND) U112.3(GND) U113.3(GND) U128.3(GND) U129.3(GND) U130.3(GND) U131.3(GND) U132.3(GND) U133.3(GND) U134.3(GND) U135.3(GND) U136.3(GND) U137.3(GND) U138.3(GND) U139.3(GND) U140.3(GND) U141.3(GND) U156.3(GND) U157.3(GND) U158.3(GND) U159.3(GND) U160.3(GND) U161.3(GND) U162.3(GND) U163.3(GND) U164.3(GND) U165.3(GND) U166.3(GND) U167.3(GND) U180.1(GND) U181.1(GND) U182.3(GND) U183.3(GND) U184.3(GND) U185.3(GND) U186.3(GND) U187.3(GND) U188.3(GND) U189.3(GND) U198.3(GND) U199.3(GND) U200.3(GND) U201.3(GND) U202.3(GND) U203.3(GND) U204.3(GND) U205.3(GND) U206.3(GND) U217.49(EP) X100.2(GND) X100.4(GND)
VDDA: C161.2 R101.2 U217.21(VDDA)
ADNS9800_CS: FPC102.7 U217.12(PA4)
ADNS9800_MOTION: FPC102.8 U217.11(PA3)
BOOT0: R103.2 SW103.3 U217.46(PB8-BOOT0)
COL1: D100.1(K) D114.1(K) D128.1(K) D140.1(C) D150.1(K) FPC101.7 U217.8(PA0)
COL2: D101.1(K) D115.1(K) D129.1(K) FPC101.6 U217.9(PA1)
COL3: D102.1(K) D116.1(K) D130.1(K) D141.1(C) D151.1(K) FPC101.5 U217.10(PA2)
COL4: D103.1(K) D117.1(K) D131.1(K) D142.1(K) D152.1(K) FPC103.3 U217.16(PC4)
COL5: D104.1(K) D118.1(K) FPC103.4 U217.17(PB0)
COL6: D105.1(K) D119.1(K) D132.1(K) D143.1(K) D153.1(K) FPC103.5 U217.18(PB1)
COL7: D106.1(K) D120.1(K) D133.1(K) D144.1(K) FPC103.6 U217.19(PB2)
COL8: D107.1(K) D121.1(K) D134.1(K) D145.1(K) D154.1(K) FPC103.7 U217.45(PB7)
COL9: D108.1(K) D122.1(K) D135.1(K) U217.43(PB5)
COL10: D109.1(K) D123.1(K) D136.1(K) D146.1(K) D155.1(K) U217.41(PB3)
COL11: D110.1(K) D124.1(K) D137.1(K) D147.1(K) D156.1(K) U217.22(PB10)
COL12: D111.1(K) D125.1(K) D138.1(K) D148.1(K) U217.40(PC11)
COL13: D112.1(K) D126.1(K) D157.1(K) U217.39(PC10)
COL14: D113.1(K) D127.1(K) D139.1(K) D149.1(K) D158.1(K) U217.38(PA15)
ENCODER_A: FPC101.2 U217.31(PA9)
ENCODER_B: FPC101.1 U217.32(PA10)
NRST: C159.1 R102.1 SW102.4 U217.7(PG10-NRST)
OSC32_IN: C170.1 U217.3(PC14-OSC32_IN) X101.2
OSC32_OUT: C173.1 U217.4(PC15-OSC32_OUT) X101.1
OSC_IN: C172.2 U217.5(PF0-OSC_IN) X100.3
OSC_OUT: C171.1 U217.6(PF1-OSC_OUT) X100.1
PA5: FPC102.6 U217.13(PA5)
PA6: FPC102.5 U217.14(PA6)
PA7: FPC102.4 U217.15(PA7)
PA8: FPC101.8 FPC103.1 U217.30(PA8)
PB4: U100.4(DIN) U217.42(PB4)
PB12: U114.1 U115.1 U116.1 U117.1 U118.1 U119.1 U120.1 U121.1 U122.1 U123.1 U124.1 U125.1 U126.1 U127.1 U217.25(PB12)
PB13: SW100.2(ON) SW101.2(ON) U190.1 U191.1 U192.1 U193.1 U194.1 U195.1 U196.1 U197.1 U217.26(PB13)
PB14: U207.1 U208.1 U209.1 U210.1 U211.1 U212.1 U213.1 U214.1 U215.1 U217.27(PB14)
PB15: U142.1 U143.1 U144.1 U145.1 U146.1 U147.1 U148.1 U149.1 U150.1 U151.1 U152.1 U153.1 U154.1 U155.1 U217.28(PB15)
PC6: U168.1 U169.1 U170.1 U171.1 U172.1 U173.1 U174.1 U175.1 U176.1 U177.1 U178.1 U179.1 U217.29(PC6)
SWCLK: H100.4 U217.37(PA14)
SWDIO: H100.3 U217.36(PA13)
USB_DM: FPC100.2 U217.33(PA11)
USB_DP: FPC100.3 U217.34(PA12)
VREF: C158.1 R100.2 U217.20(VREF+)
WS2812_2: U113.2(DOUT) U128.4(DIN)
WS2812_3: U141.2(DOUT) U156.4(DIN)
WS2812_4: U167.2(DOUT) U180.2(DI)
WS2812_5: U189.2(DOUT) U198.4(DIN)
$2N63686: U163.2(DOUT) U164.4(DIN)
$2N63687: D135.2(A) U175.2
$2N63726: U185.2(DOUT) U186.4(DIN)
$2N63776: U162.2(DOUT) U163.4(DIN)
$2N63780: D134.2(A) U174.2
$2N63781: U161.2(DOUT) U162.4(DIN)
$2N63811: D145.2(A) U193.2
$2N63812: D144.2(A) U192.2
$2N63860: U184.2(DOUT) U185.4(DIN)
$2N63861: U183.2(DOUT) U184.4(DIN)
$2N63863: D133.2(A) U173.2
$2N63867: U135.2(DOUT) U136.4(DIN)
$2N63868: D107.2(A) U121.2
$2N63869: U134.2(DOUT) U135.4(DIN)
$2N63870: D121.2(A) U149.2
$2N63871: U136.2(DOUT) U137.4(DIN)
$2N63872: D122.2(A) U150.2
$2N63873: D120.2(A) U148.2
$2N63874: D108.2(A) U122.2
$2N63875: D106.2(A) U120.2
$2N63876: U133.2(DOUT) U134.4(DIN)
$2N63877: U108.2(DOUT) U109.4(DIN)
$2N63880: U107.2(DOUT) U108.4(DIN)
$2N63881: U106.2(DOUT) U107.4(DIN)
$2N63882: U105.2(DOUT) U106.4(DIN)
$2N63883: U104.2(DOUT) U105.4(DIN)
$2N63884: D139.2(A) U179.2
$2N63888: D127.2(A) U155.2
$2N63889: U112.2(DOUT) U113.4(DIN)
$2N63890: U140.2(DOUT) U141.4(DIN)
$2N63891: U165.2(DOUT) U166.4(DIN)
$2N63895: D138.2(A) U178.2
$2N63897: D126.2(A) U154.2
$2N63898: U139.2(DOUT) U140.4(DIN)
$2N63899: U111.2(DOUT) U112.4(DIN)
$2N63900: U138.2(DOUT) U139.4(DIN)
$2N63901: D125.2(A) U153.2
$2N63902: U110.2(DOUT) U111.4(DIN)
$2N64006: D157.2(A) U214.2
$2N64036: D158.2(A) U215.2
$2N64037: U205.2(DOUT) U206.4(DIN)
$2N64050: D149.2(A) U197.2
$2N64052: D148.2(A) U196.2
$2N64063: U188.2(DOUT) U189.4(DIN)
$2N64067: U186.2(DOUT) U187.4(DIN)
$2N64071: U187.2(DOUT) U188.4(DIN)
$2N64077: D147.2(A) U195.2
$2N64079: D156.2(A) U213.2
$2N64081: U204.2(DOUT) U205.4(DIN)
$2N64085: U203.2(DOUT) U204.4(DIN)
$2N64089: D155.2(A) U212.2
$2N64090: D146.2(A) U194.2
$2N64091: D153.2(A) U210.2
$2N64093: D151.2(A) U208.2
$2N64095: U198.2(DOUT) U199.4(DIN)
$2N64099: U202.2(DOUT) U203.4(DIN)
$2N64100: D154.2(A) U211.2
$2N64112: D129.2(A) U169.2
$2N64114: U156.2(DOUT) U157.4(DIN)
$2N64126: U157.2(DOUT) U158.4(DIN)
$2N64130: U158.2(DOUT) U159.4(DIN)
$2N64131: D130.2(A) U170.2
$2N64132: D128.2(A) U168.2
$2N64133: D152.2(A) U209.2
$2N64135: D150.2(A) U207.2
$2N64136: U201.2(DOUT) U202.4(DIN)
$2N64144: D140.2(A) SW100.3(NC)
$2N64146: D115.2(A) U143.2
$2N64147: D116.2(A) U144.2
$2N64148: U129.2(DOUT) U130.4(DIN)
$2N64149: U128.2(DOUT) U129.4(DIN)
$2N64151: D114.2(A) U142.2
$2N64152: U130.2(DOUT) U131.4(DIN)
$2N64153: D137.2(A) U177.2
$2N64154: D124.2(A) U152.2
$2N64155: U166.2(DOUT) U167.4(DIN)
$2N64159: D136.2(A) U176.2
$2N64160: D123.2(A) U151.2
$2N64161: U109.2(DOUT) U110.4(DIN)
$2N64162: U164.2(DOUT) U165.4(DIN)
$2N64163: U137.2(DOUT) U138.4(DIN)
$2N64175: D141.2(A) SW101.3(NC)
$2N64177: U181.4(DO) U182.4(DIN)
$2N64183: U180.4(DO) U181.2(DI)
$2N64187: U199.2(DOUT) U200.4(DIN)
$2N64191: U160.2(DOUT) U161.4(DIN)
$2N64192: D132.2(A) U172.2
$2N64193: U159.2(DOUT) U160.4(DIN)
$2N64197: D143.2(A) U191.2
$2N64198: U200.2(DOUT) U201.4(DIN)
$2N64202: D142.2(A) U190.2
$2N64203: U182.2(DOUT) U183.4(DIN)
$2N64207: D119.2(A) U147.2
$2N64213: D118.2(A) U146.2
$2N64214: U131.2(DOUT) U132.4(DIN)
$2N64215: U132.2(DOUT) U133.4(DIN)
$2N64216: D105.2(A) U119.2
$2N64217: D104.2(A) U118.2
$2N64218: U103.2(DOUT) U104.4(DIN)
$2N64219: D103.2(A) U117.2
$2N64220: D131.2(A) U171.2
$2N64221: D117.2(A) U145.2
$2N64222: D113.2(A) U127.2
$2N64223: D112.2(A) U126.2
$2N64224: D102.2(A) U116.2
$2N64225: D101.2(A) U115.2
$2N64226: D100.2(A) U114.2
$2N64227: U102.2(DOUT) U103.4(DIN)
$2N64228: U101.2(DOUT) U102.4(DIN)
$2N64229: U100.2(DOUT) U101.4(DIN)
$2N64231: D109.2(A) U123.2
$2N64232: D110.2(A) U124.2
$2N64233: D111.2(A) U125.2
$3N2830: LED100.2(A) R104.2

Not connected (* = marked no-connect by the designer): FPC103 2* 8*; LDO100 4(NC)*; SW100 1(C)*; SW101 1(C)*; SW102 3*; SW103 4*; U206 2(DOUT)*; U217 2(PC13)* 24(PB11)* 44(PB6)* 47(PB9)*

## Notes on the sheets
sheet 2
- Type-C
- 主控
- BOOT & RESET
- 滚轮
- 电源
- 轨迹球
- 方向
- 晶振
- One-Handed Keyboard_MR
